# Altium schematic sheet POWER.SchDoc
size A
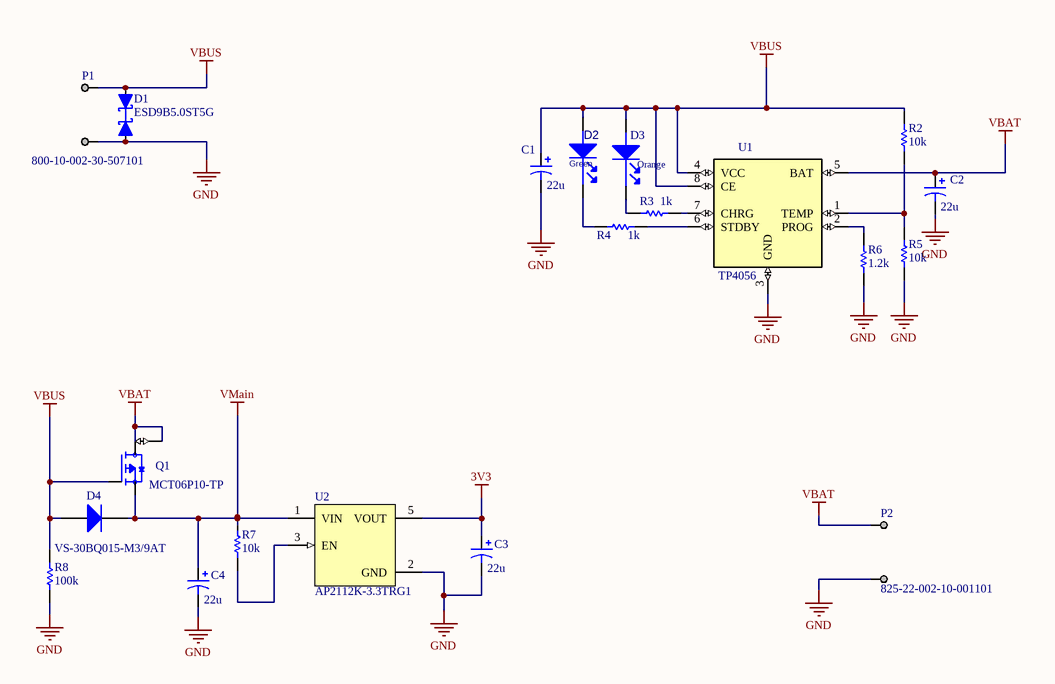
[diagram p0: POWER.SchDoc]

## Parts
C1  22u  [CAPPRD250W50D630H1120B]
C2  22u  [CAPPRD250W50D630H1120B]
C3  22u  [CAPPRD250W50D630H1120B]
C4  22u  [CAPPRD250W50D630H1120B]
D1  ESD9B5.0ST5G  [ESD9B5.0ST5G]
D2  Green  [LED_0603]
D3  Orange  [LED_0603]
D4  VS-30BQ015-M3/9AT  [DO-214AB (SMC)]
P1  800-10-002-30-507101  [800-10-002-30-507101]
P2  825-22-002-10-001101  [825-22-002-10-001101]
Q1  MCT06P10-TP  [SOT223]
R2  10k  [R0805]
R3  1k  [R0805]
R4  1k  [R0805]
R5  10k  [R0805]
R6  1.2k  [R0805]
R7  10k  [R0805]
R8  100k  [R0805]
U1  TP4056  [SOP-8]
U2  AP2112K-3.3TRG1  [SOT95P285X140-5N]

## Nets
3V3: C3.1 U2.5(VOUT)
GND: C1.2 C2.2 C3.2 C4.2 D1.1 P1.2 P2.1 R5.1 R6.1 R8.1 U1.3(GND) U2.2(GND)
VBAT: C2.1 P2.2 Q1.2(D) Q1.4(D2) U1.5(BAT)
VBUS: C1.1 D1.2 D2.2(ANODE) D3.2(ANODE) D4.1(A) P1.1 Q1.1(G) R2.2 R8.2 U1.4(VCC) U1.8(CE)
VMain: C4.1 D4.2(K) Q1.3(S) R7.2 U2.1(VIN)
NetD2_1: D2.1(cathode) R4.2
NetD3_1: D3.1(cathode) R3.2
NetR2_1: R2.1 R5.2 U1.1(TEMP)
NetR3_1: R3.1 U1.7(CHRG)
NetR4_1: R4.1 U1.6(STDBY)
NetR6_2: R6.2 U1.2(PROG)
NetR7_1: R7.1 U2.3(EN)

## Library data of the parts
C1-C4 = UCS2C221MHD1TN: CAP ALUM 220UF 20% 160V RADIAL; Manufacturer: Nichicon; Ripple Current: 2.37A; Life (Hours): 10000Hour; Lead Diameter: 0.8mm; Supplier 1: Digi-Key; Manufacturer Part Number: UCS2C221MHD1TN; Stock 1: 84250; Pricing 1: 250=0.7974, 500=0.6778, 750=0.6379, 1250=0.5981, 2500=0.5582, 6250=0.5383, 12500=0.5084, 25000=0.4984 (USD); Mount: Through Hole; Case/Package: Radial; Min Operating Temperature: -40°C; Max Operating Temperature: 105°C; Capacitance: 220uF; Tolerance: 20%; Package Quantity: 250; Packaging: Tape and Reel; Voltage Rating: 160V; Termination: Radial; Diameter: 16mm; Height: 25mm; Lead Pitch: 7.5mm; Height - Seated (Max): 1.063inch; Radiation Hardening: No; ComponentLink1URL: http://www.nichicon.co.jp/english/products/pdfs/e-cs.pdf?src-supplier=Avnet; ComponentLink1Description: http://www.nichicon.co.jp/english/products/pdfs/e-cs.pdf?src-supplier=Avnet; ComponentLink2URL: http://nichicon-us.com/english/products/pdfs/e-ucs.pdf?src-supplier=Digi-Key; ComponentLink2Description: http://nichicon-us.com/english/products/pdfs/e-ucs.pdf?src-supplier=Digi-Key; ComponentLink3URL: http://nichicon-us.com/english/products/pdfs/e-ch_ta.pdf?src-supplier=Digi-Key; ComponentLink3Description: http://nichicon-us.com/english/products/pdfs/e-ch_ta.pdf?src-supplier=Digi-Key; ComponentLink4URL: http://www.nichicon.co.jp/english/products/pdfs/e-cs.pdf?src-supplier=Avnet+Europe; ComponentLink4Description: http://www.nichicon.co.jp/english/products/pdfs/e-cs.pdf?src-supplier=Avnet+Europe; Supplier Part Number 1: 493-13277-3-ND
D1 = ESD9B5.0ST5G: TVS DIODE 5V SOD923
D2 = LG L29K-G2J1-24-Z: LED SMARTLED GREEN 570NM 0603; Manufacturer: OSRAM Opto Semiconductors Inc; .Checked PCB: used; Current - Test: 2mA; Voltage - Forward (Vf) Typ: 1.7V; Luminous Flux @ Current - Test: 12 mlm; Millicandela Rating: 3.92mcd; Wavelength - Peak: 572nm; Lens Type: Diffused; Lens Style/Size: Rectangle with Flat Top, 1.3mm x 0.8mm; Viewing Angle: 160°; Regulator Topology: Positive Fixed; Voltage - Output: 2.5V; Voltage - Input: 2.6 V ~ 6 V; Voltage - Dropout (Typical): 0.16V @ 500mA; Number of Regulators: 1; Current - Output: 500mA; Current - Limit (Min): 600mA; .Checked SCH: used; Category: Optoelectronics; Supplier Part Number: 475-2709-1-ND; Family: LEDs - <75mA, Discre; Manufacturer Part Number: LG L29K-G2J1-24-Z; Price 1k [$]: 0.08744; Value: Green; Color: Green; Package / Case: 0603 (1608 Metric); Supplier: Digikey; Supplier 1: Digi-Key; Supplier Part Number 1: 475-2709-1-ND; RoHS: RoHS Compliant; Stock 1: 30318; Pricing 1: 1=0.16, 10=0.137, 100=0.1093, 250=0.09564, 500=0.08744 (USD); Wavelength - Dominant: 570nm; Size / Dimension: 1.70mm L x 0.80mm W; Height: 0.65mm; Mounting Type: Surface Mount; Packaging: Cut Tape (CT); ComponentLink1URL: http://catalog.osram-os.com/catalogue/catalogue.do;jsessionid=32CB61882C089EDD4B6D0A54E7E1F117?act=downloadFile&favOid=020000020000138e000100b6; ComponentLink1Description: http://catalog.osram-os.com/catalogue/catalogue.do;jsessionid=32CB61882C089EDD4B6D0A54E7E1F117?act=downloadFile&favOid=020000020000138e000100b6; Operating Temperature: -40°C ~ 125°C; Supplier Device Package: 6-TMLF® (1.6x1.6); ComponentLink2URL: http://www.micrel.com/_PDF/mic5353.pdf; ComponentLink2Description: http://www.micrel.com/_PDF/mic5353.pdf
D3 = LO L29K-H2K1-24-Z: LED SMARTLED ORANGE 606NM 0603; Manufacturer: OSRAM Opto Semiconductors Inc; Millicandela Rating: 6.3mcd; Voltage - Forward (Vf) Typ: 1.8V; Current - Test: 2mA; Wavelength - Peak: 610nm; Viewing Angle: 160°; Lens Type: Diffused; Lens Style/Size: Rectangle with Flat Top, 1.3mm x 0.8mm; Luminous Flux @ Current - Test: 25 mlm; .Checked PCB: used; Supplier 1: Digi-Key; Supplier Part Number 1: 475-2740-1-ND; Manufacturer Part Number: LO L29K-H2K1-24-Z; RoHS: RoHS Compliant; Category: Optoelectronics; Stock 1: 15900; Pricing 1: 1=0.17, 10=0.141, 100=0.1127, 250=0.0986, 500=0.09016 (USD); Color: Orange; Wavelength - Dominant: 606nm; Package / Case: 0603 (1608 Metric); Size / Dimension: 1.70mm L x 0.80mm W; Height: 0.65mm; Mounting Type: Surface Mount; Packaging: Cut Tape (CT); ComponentLink1URL: http://catalog.osram-os.com/catalogue/catalogue.do;jsessionid=302CF83AF637AE24E40AEB0ADA267EDD?act=downloadFile&favOid=020000010003f9de000100b6; ComponentLink1Description: http://catalog.osram-os.com/catalogue/catalogue.do;jsessionid=302CF83AF637AE24E40AEB0ADA267EDD?act=downloadFile&favOid=020000010003f9de000100b6; .Checked SCH: used
D4 = VS-30BQ015-M3/9AT: Diode Schottky Rectifier 25V 3A 2-Pin DO-214AB Plastic T/R; Manufacturer: Vishay Semiconductors; Forward Current: 4A; Max Reverse Current: 4mA; Max Repetitive Reverse Voltage (Vrrm): 15V; Forward Voltage: 350mV; Max Forward Surge Current (Ifsm): 650A; Element Configuration: Single; Supplier 1: Digi-Key; Manufacturer Part Number: VS-30BQ015-M3/9AT; Stock 1: 4165; Pricing 1: 1=0.89, 10=0.752, 100=0.5876, 500=0.4783, 1000=0.3826 (USD); Mount: Surface Mount; Case/Package: SMC; Number of Pins: 2; Min Operating Temperature: -55°C; Max Operating Temperature: 125°C; Packaging: Tape and Reel; Average Rectified Current: 3A; Peak Non-Repetitive Surge Current: 650A; Max Reverse Voltage (DC): 15V; Length: 7.11mm; Width: 6.22mm; REACH SVHC: No SVHC; Lead Free: Lead Free; ComponentLink1URL: http://www.vishay.com/docs/93359/30bq015m.pdf?src-supplier=Digi-Key; ComponentLink1Description: http://www.vishay.com/docs/93359/30bq015m.pdf?src-supplier=Digi-Key; ComponentLink2URL: http://www.farnell.com/datasheets/2119784.pdf?src-supplier=Farnell; ComponentLink2Description: http://www.farnell.com/datasheets/2119784.pdf?src-supplier=Farnell; ComponentLink3URL: http://www.vishay.com/docs/93359/30bq015m.pdf?src-supplier=Avnet+Asia; ComponentLink3Description: http://www.vishay.com/docs/93359/30bq015m.pdf?src-supplier=Avnet+Asia; ComponentLink4URL: http://www.farnell.com/datasheets/2119784.pdf?src-supplier=Element14; ComponentLink4Description: http://www.farnell.com/datasheets/2119784.pdf?src-supplier=Element14; ComponentLink5URL: http://www.vishay.com/docs/93359/vs-30bq015m.pdf?src-supplier=Digi-Key; ComponentLink5Description: http://www.vishay.com/docs/93359/vs-30bq015m.pdf?src-supplier=Digi-Key; ComponentLink6URL: http://www.mouser.com/ds/2/427/30bq015m-1074144.pdf?src-supplier=Mouser; ComponentLink6Description: http://www.mouser.com/ds/2/427/30bq015m-1074144.pdf?src-supplier=Mouser; Supplier Part Number 1: VS-30BQ015-M3/9ATGICT-ND
P1 = 800-10-002-30-507101: 2 Position Spring Mating Target Connector Surface Mount
P2 = 825-22-002-10-001101: 2 Position Spring Piston Connector Through Hole
Q1 = MCT06P10-TP: P-channel MOSFETSOT-223; Manufacturer: MCC; Supplier 1: Digi-Key; Manufacturer Part Number: MCT06P10-TP; Stock 1: 19805; Pricing 1: 1=0.53, 10=0.45, 25=0.42, 100=0.312, 250=0.2964, 500=0.2436, 1000=0.198 (USD); Supplier Part Number 1: MCT06P10-TPMSDKR-ND
R2-R8 = RC0805FR-071KL: RES SMD 1K OHM 1% 1/8W 0805; Manufacturer: Yageo; Power (Watts): 0.125W, 1/8W; Temperature Coefficient: ±100ppm/°C; .Creator: MM; .Checked PCB: RF; Supplier 1: Digi-Key; Manufacturer Part Number: RC0805FR-071KL; RoHS: RoHS Compliant; Category: Resistors; Stock 1: 3497185; Pricing 1: 1=0.1, 10=0.021, 25=0.0148, 100=0.0084, 250=0.0064, 500=0.0051, 1000=0.00376, 2500=0.00326 (USD); Packaging: Cut Tape (CT); Resistance (Ohms): 1k; Tolerance: ±1%; Composition: Thick Film; Features: Moisture Resistant; Operating Temperature: -55°C ~ 155°C; Package / Case: 0805 (2012 Metric); Supplier Device Package: 0805; Size / Dimension: 0.079" L x 0.049" W (2.00mm x 1.25mm); Height: 0.024" (0.60mm); Number of Terminations: 2; ComponentLink1URL: http://www.yageo.com/documents/recent/PYu-RC_Group_51_RoHS_L_1.pdf; ComponentLink1Description: http://www.yageo.com/documents/recent/PYu-RC_Group_51_RoHS_L_1.pdf; Supplier Part Number 1: 311-1.00KCRCT-ND; .Checked SCH: RF
U2 = AP2112K-3.3TRG1: IC REG LINEAR 3.3V 600MA SOT25; Manufacturer: Diodes; Min Input Voltage: 2.5V; Number of Outputs: 1; Dropout Voltage: 250mV; Max Input Voltage: 6V; Quiescent Current: 55uA; Polarity: Positive; Accuracy: 1.5%; Output Type: Fixed; Supplier 1: Digi-Key; Manufacturer Part Number: AP2112K-3.3TRG1; Stock 1: 20198; Pricing 1: 1=0.47, 10=0.355, 25=0.32, 100=0.1745, 250=0.1687, 500=0.1513, 1000=0.1164 (USD); Mount: Surface Mount; Case/Package: SOT-23-5; Number of Pins: 5; Min Operating Temperature: -40°C; Max Operating Temperature: 85°C; Package Quantity: 1; Packaging: Tape and Reel; Output Voltage: 3.3V; Output Current: 600mA; Number of Regulators: 1; Max Output Current: 600mA; Length: 3.1mm; Height: 1.3mm; Width: 1.7mm; Lead Free: Lead Free; ComponentLink1URL: http://www.diodes.com/datasheets/AP2112.pdf?src-supplier=Avnet; ComponentLink1Description: http://www.diodes.com/datasheets/AP2112.pdf?src-supplier=Avnet; ComponentLink2URL: https://www.diodes.com/assets/Datasheets/AP2112.pdf?src-supplier=Digi-Key; ComponentLink2Description: https://www.diodes.com/assets/Datasheets/AP2112.pdf?src-supplier=Digi-Key; Supplier Part Number 1: AP2112K-3.3TRG1DIDKR-ND